# Altium schematic sheet 5.USB-RTC-RST.SchDoc: MC-IMX6UL-CORE
size A3; DrawnBy: DrawnBy; DocumentNumber: MC-IMX6UL-CORE; Revision: V1.1; SheetNumber: 5 of 9
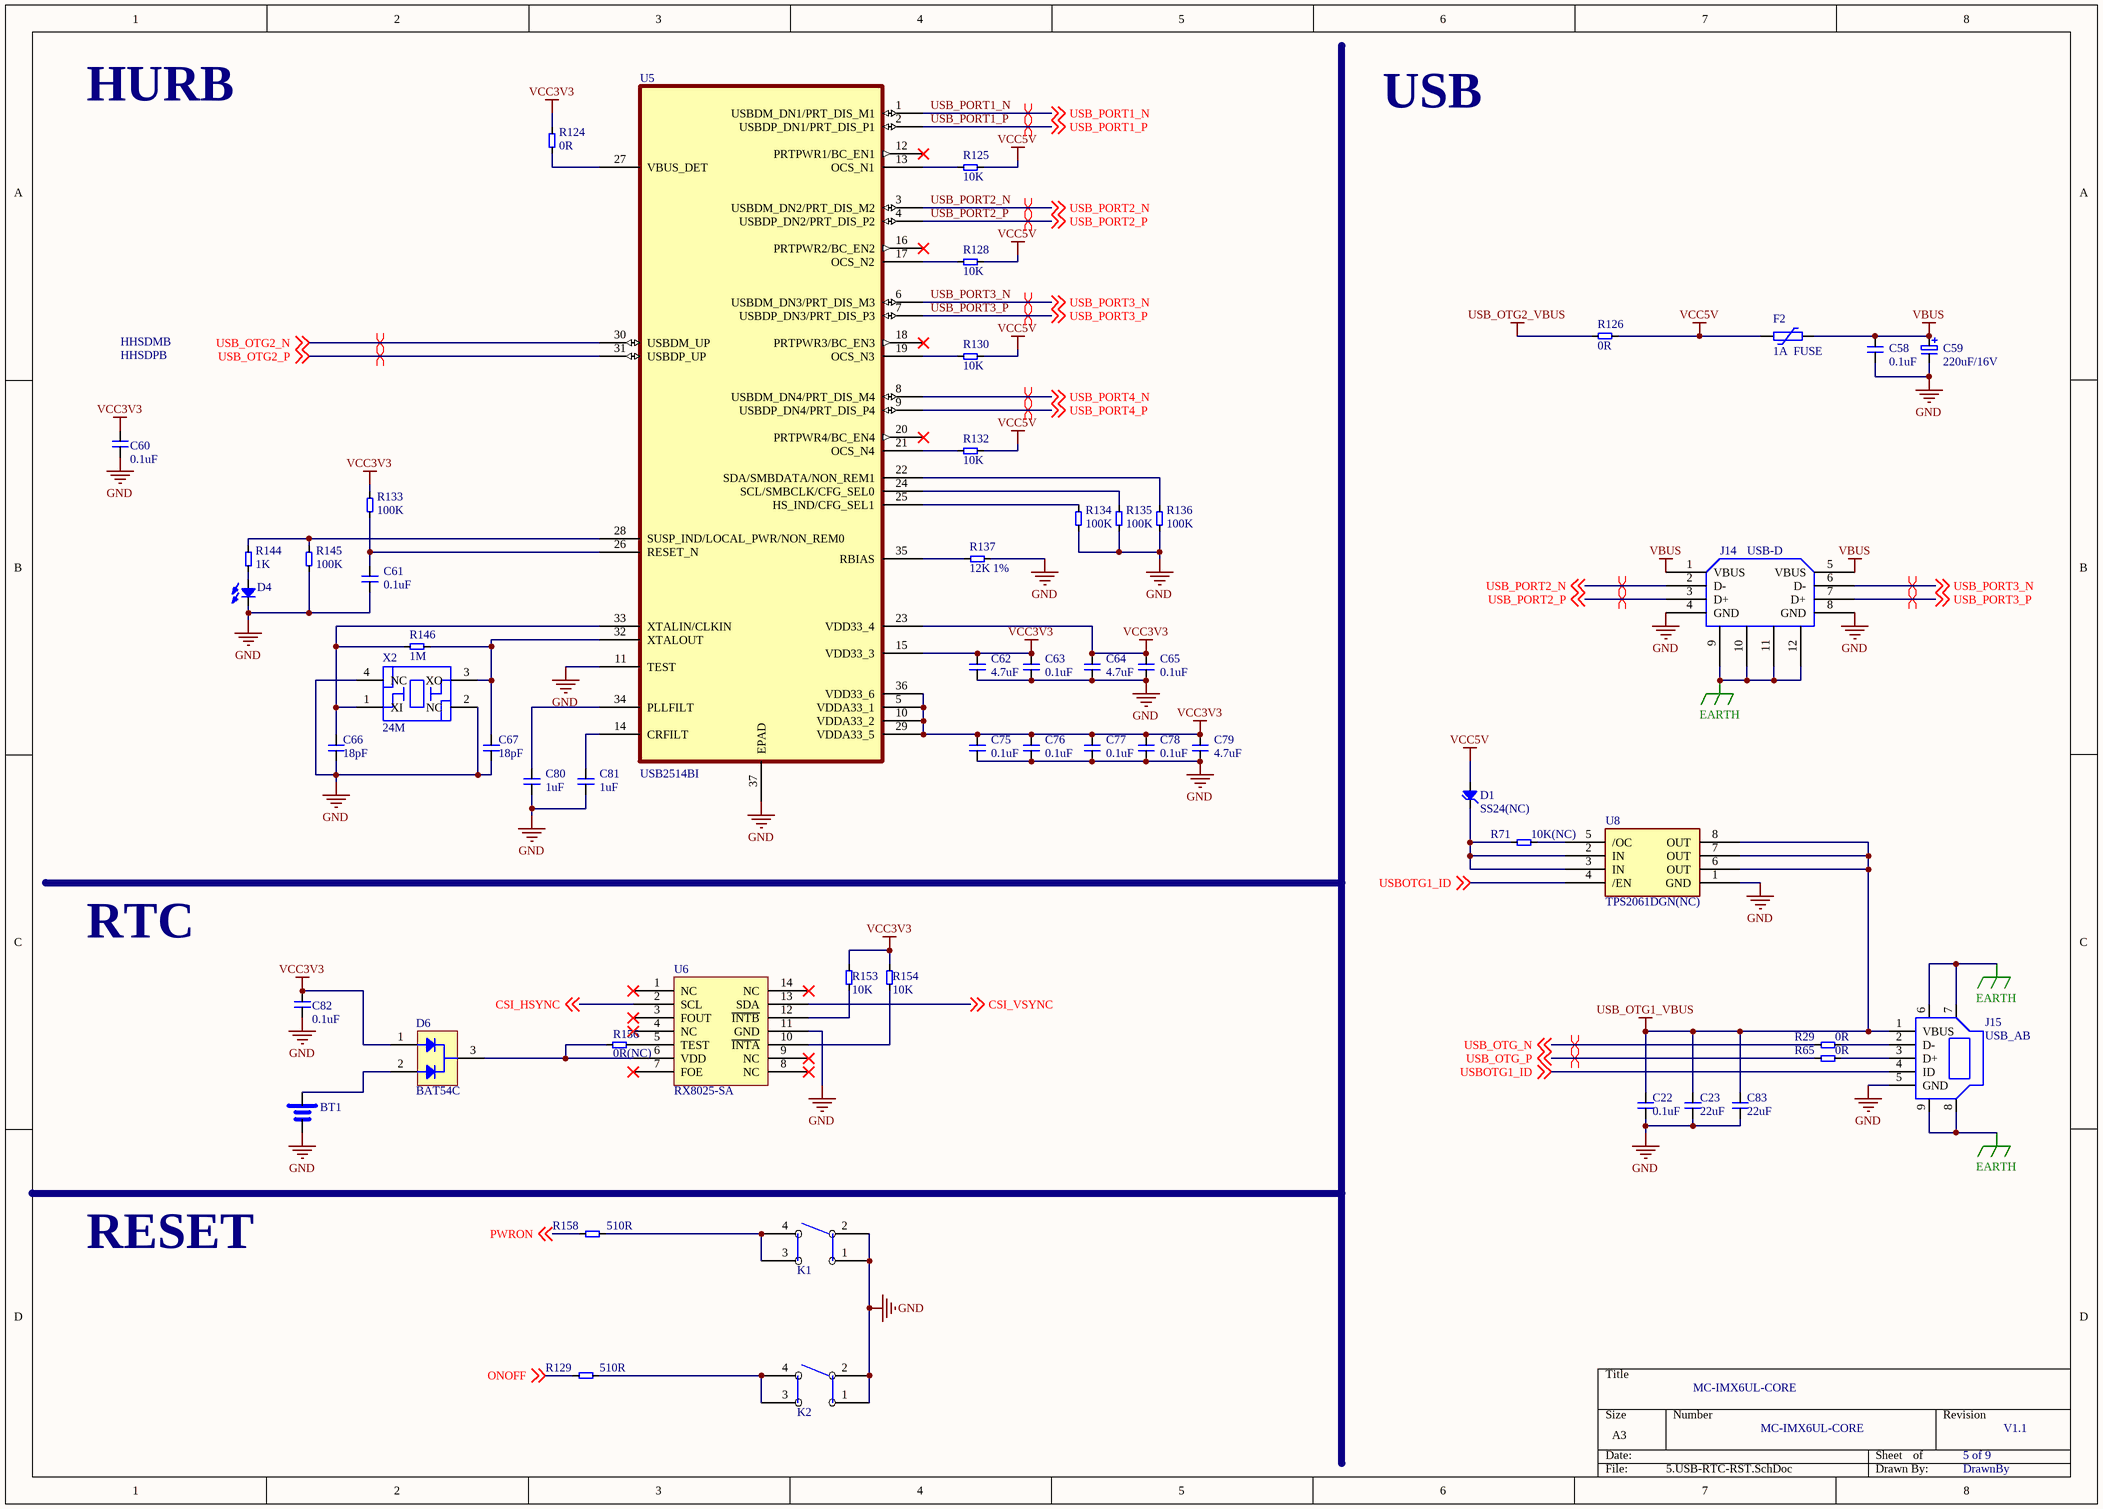
[diagram p0: 5.USB-RTC-RST.SchDoc]

## Parts
BT1  (no value)  [CR1220]
C22  0.1uF  [0603C]
C23  22uF  [0805C]
C58  0.1uF  [0603C]
C59  220uF/16V  [RAD-3/6]
C60  0.1uF  [0603C]
C61  0.1uF  [0603C]
C62  4.7uF  [0603C]
C63  0.1uF  [0603C]
C64  4.7uF  [0603C]
C65  0.1uF  [0603C]
C66  18pF  [0603C]
C67  18pF  [0603C]
C75  0.1uF  [0603C]
C76  0.1uF  [0603C]
C77  0.1uF  [0603C]
C78  0.1uF  [0603C]
C79  4.7uF  [0603C]
C80  1uF  [0603C]
C81  1uF  [0603C]
C82  0.1uF  [0603C]
C83  22uF  [0805C]
D1  SS24(NC)  [SMA]
D4  发光二极管  [0603D]  (value not drawn)
D6  BAT54C  [SOT-23]
F2  1A  FUSE  [1812F]
J14  USB-D  [USB-D]
J15  USB_AB  [USB-AB]
K1  按键  [SS-SPB-4.5]  (value not drawn)
K2  按键  [SS-SPB-4.5]  (value not drawn)
R29  0R  [0603R]
R65  0R  [0603R]
R71  10K(NC)  [0603R]
R124  0R  [0603R]
R125  10K  [0603R]
R126  0R  [0603R]
R128  10K  [0603R]
R129  510R  [0603R]
R130  10K  [0603R]
R132  10K  [0603R]
R133  100K  [0603R]
R134  100K  [0603R]
R135  100K  [0603R]
R136  100K  [0603R]
R137  12K 1%  [0603R]
R144  1K  [0603R]
R145  100K  [0603R]
R146  1M  [0603R]
R153  10K  [0603R]
R154  10K  [0603R]
R156  0R(NC)  [0603R]
R158  510R  [0603R]
U5  USB2514BI  [QFN-36]
U6  RX8025-SA  [SOP14-1.27]
U8  TPS2061DGN(NC)  [MSOP-8]
X2  24M  [OSC4-3225]

## Nets
EARTH: J14.9 J14.10 J14.11 J14.12 J15.6(GND) J15.7(GND) J15.8(GND) J15.9(GND)
GND: BT1.2 C22.1 C23.1 C58.1 C59.2 C60.1 C61.1 C62.1 C63.1 C64.1 C65.1 C66.1 C67.1 C75.1 C76.1 C77.1 C78.1 C79.1 C80.1 C81.1 C82.1 C83.1 D4.K J14.4(GND) J14.8(GND) J15.5(GND) K1.1 K1.2 K2.1 K2.2 R134.2 R135.2 R136.2 R137.1 R145.2 U5.11(TEST) U5.37(EPAD) U6.11(GND) U8.1(GND) X2.2(NC) X2.4(NC)
USB_OTG1_VBUS: C22.2 C23.2 C83.2 J15.1(VBUS) U8.6(OUT) U8.7(OUT) U8.8(OUT)
USB_OTG2_VBUS: R126.2
VBUS: C58.2 C59.1 F2.2 J14.1(VBUS) J14.5(VBUS)
VCC3V3: C60.2 C62.2 C63.2 C64.2 C65.2 C75.2 C76.2 C77.2 C78.2 C79.2 C82.2 D6.1 R124.2 R133.1 R153.2 R154.2 U5.5(VDDA33_1) U5.10(VDDA33_2) U5.15(VDD33_3) U5.23(VDD33_4) U5.29(VDDA33_5) U5.36(VDD33_6)
VCC5V: D1.A F2.1 R125.1 R126.1 R128.1 R130.1 R132.1
CSI_HSYNC: U6.2(SCL) ; off-sheet CSI_HSYNC
CSI_VSYNC: U6.13(SDA) ; off-sheet CSI_VSYNC
ONOFF: R129.2 ; off-sheet ONOFF
PWRON: R158.2 ; off-sheet PWRON
USB_OTG2_N: U5.30(USBDM_UP) ; off-sheet USB_OTG2_N
USB_OTG2_P: U5.31(USBDP_UP) ; off-sheet USB_OTG2_P
USB_OTG_N: R29.2 ; off-sheet USB_OTG_N
USB_OTG_P: R65.2 ; off-sheet USB_OTG_P
USB_PORT1_N: U5.1(USBDM_DN1/PRT_DIS_M1) ; off-sheet USB_PORT1_N
USB_PORT1_P: U5.2(USBDP_DN1/PRT_DIS_P1) ; off-sheet USB_PORT1_P
USB_PORT2_N: J14.2(D-) U5.3(USBDM_DN2/PRT_DIS_M2) ; off-sheet USB_PORT2_N
USB_PORT2_P: J14.3(D+) U5.4(USBDP_DN2/PRT_DIS_P2) ; off-sheet USB_PORT2_P
USB_PORT3_N: J14.6(D-) U5.6(USBDM_DN3/PRT_DIS_M3) ; off-sheet USB_PORT3_N
USB_PORT3_P: J14.7(D+) U5.7(USBDP_DN3/PRT_DIS_P3) ; off-sheet USB_PORT3_P
USB_PORT4_N: U5.8(USBDM_DN4/PRT_DIS_M4) ; off-sheet USB_PORT4_N
USB_PORT4_P: U5.9(USBDP_DN4/PRT_DIS_P4) ; off-sheet USB_PORT4_P
USBOTG1_ID: J15.4(ID) U8.4(/EN) ; off-sheet USBOTG1_ID
NetBT1_1: BT1.1 D6.2
NetC61_2: C61.2 R133.2 U5.26(RESET_N)
NetC66_2: C66.2 R146.1 U5.33(XTALIN/CLKIN) X2.1(XI)
NetC67_2: C67.2 R146.2 U5.32(XTALOUT) X2.3(XO)
NetC80_2: C80.2 U5.34(PLLFILT)
NetC81_2: C81.2 U5.14(CRFILT)
NetD1_K: D1.K R71.2 U8.2(IN) U8.3(IN)
NetD4_A: D4.A R144.1
NetD6_3: D6.3 R156.2 U6.6(VDD)
NetJ15_2: J15.2(D-) R29.1
NetJ15_3: J15.3(D+) R65.1
NetK1_3: K1.3 K1.4 R158.1
NetK2_3: K2.3 K2.4 R129.1
NetR71_1: R71.1 U8.5(/OC)
NetR124_1: R124.1 U5.27(VBUS_DET)
NetR125_2: R125.2 U5.13(OCS_N1)
NetR128_2: R128.2 U5.17(OCS_N2)
NetR130_2: R130.2 U5.19(OCS_N3)
NetR132_2: R132.2 U5.21(OCS_N4)
NetR134_1: R134.1 U5.25(HS_IND/CFG_SEL1)
NetR135_1: R135.1 U5.24(SCL/SMBCLK/CFG_SEL0)
NetR136_1: R136.1 U5.22(SDA/SMBDATA/NON_REM1)
NetR137_2: R137.2 U5.35(RBIAS)
NetR144_2: R144.2 R145.1 U5.28(SUSP_IND/LOCAL_PWR/NON_REM0)
NetR153_1: R153.1 U6.12(~{INTB})
NetR154_1: R154.1 U6.10(~{INTA})
NetR156_1: R156.1 U6.5(TEST)

Not connected (* = marked no-connect by the designer): U5 12(PRTPWR1/BC_EN1)* 16(PRTPWR2/BC_EN2)* 18(PRTPWR3/BC_EN3)* 20(PRTPWR4/BC_EN4)*; U6 1(NC)* 3(FOUT)* 4(NC)* 7(FOE)* 8(NC)* 9(NC)* 14(NC)*

## Layout directives
differential pair: USB_OTG2_N, USB_OTG2_P, USB_OTG_N, USB_OTG_P, USB_PORT1_N, USB_PORT1_P, USB_PORT2_N, USB_PORT2_P, USB_PORT3_N, USB_PORT3_P, USB_PORT4_N, USB_PORT4_P

## Notes on the sheet
- HURB
- USB
- HHSDMB
- HHSDPB
- RTC
- RESET

## Library data of the parts
BT1 = 电池
C22 C23 C58 C60-C67 C75-C83 = 电容
C59 = 直插电解电容
D1 = SS24: DIODES: *
D6 = BAT54C: SCHOTTKY DIODE
F2 = FUSE: 贴片自恢复保险丝
J14 = USB-D: USB DOUBLE PORTS
J15 = USB_AB: 小USB插痤
R29 R65 R71 R124-R126 R128-R130 R132-R137 R144-R146 R153 R154 R156 R158 = 电阻
U5 = USB2514
U6 = RX8025-SA: I2C interface RTC with crystal built-in
U8 = TPS2061: TPS2061DGN
X2 = 表贴晶体: 4PIN表贴晶体